# EAGLE design StatusBot-1 (EAGLE 7.2.0)
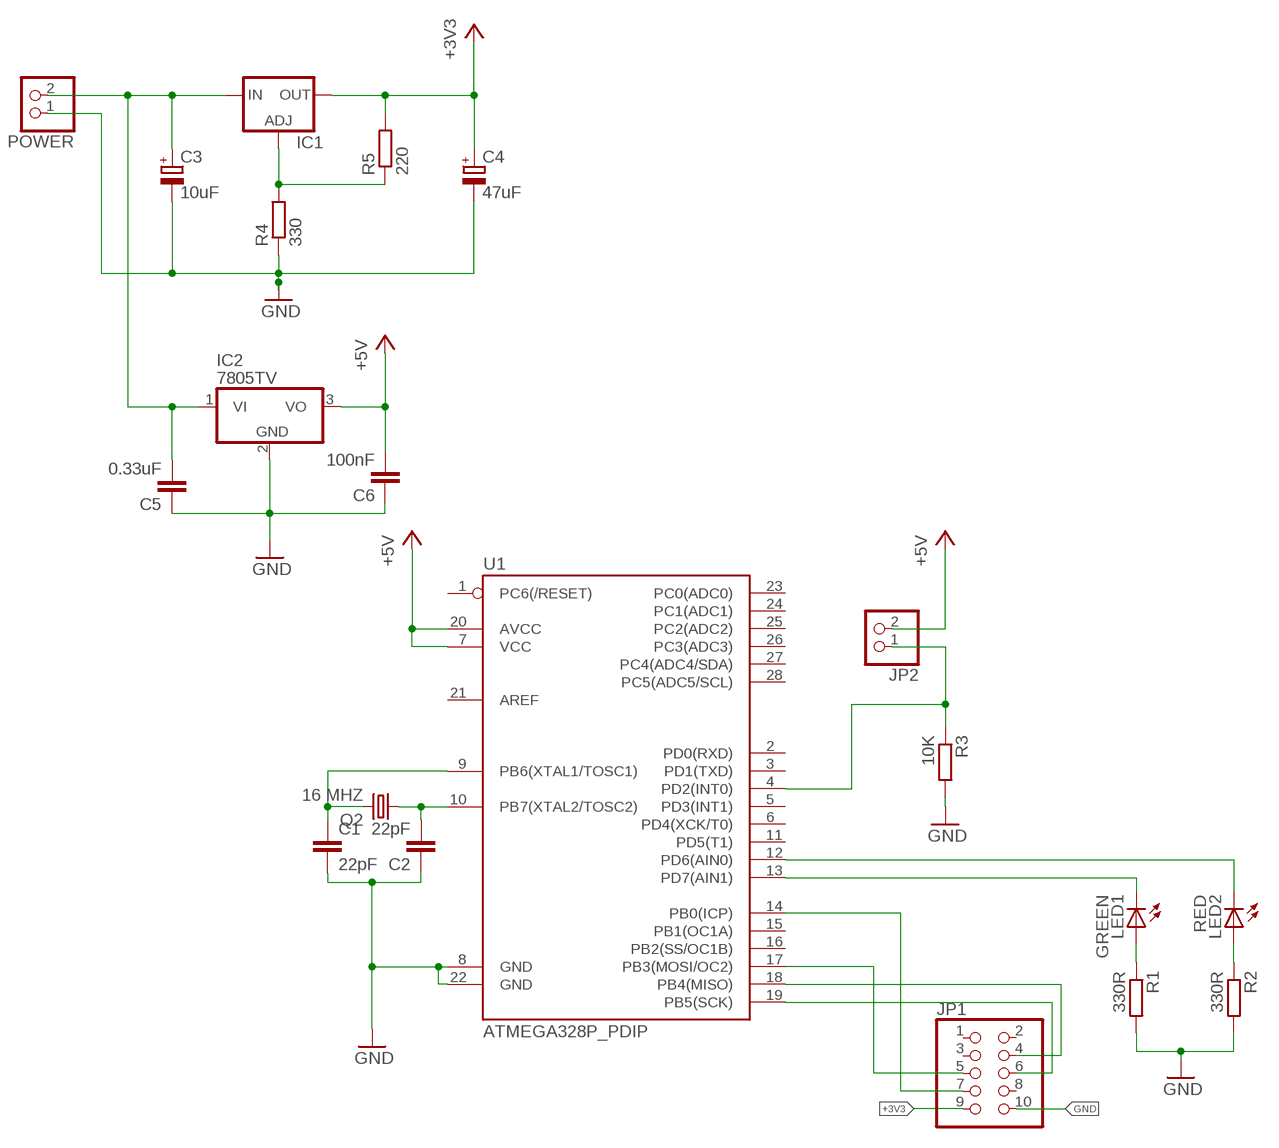
[diagram p0: schematic, sheet 1]

## Parts
C1  22pF  C-EU025-024X044  [C025-024X044]
C2  22pF  C-EU025-024X044  [C025-024X044]
C3  10uF  CPOL-EUE3.5-8  [E3,5-8]
C4  47uF  CPOL-EUE3.5-8  [E3,5-8]
C5  0.33uF  C-EU025-024X044  [C025-024X044]
C6  100nF  C-EU025-024X044  [C025-024X044]
IC1  LM317TS  [317TS]
IC2  7805TV  [TO220V]
JP1  PINHD-2X5  [2X05]
JP2  PINHD-1X2  [1X02]
LED1  GREEN  LED5MM  [LED5MM]
LED2  RED  LED5MM  [LED5MM]
POWER  PINHD-1X2  [1X02]
Q2  16 MHZ  CRYSTALHC49S  [HC49/S]
R1  330R  R-EU_0204/5  [0204/5]
R2  330R  R-EU_0204/5  [0204/5]
R3  10K  R-EU_0204/5  [0204/5]
R4  330  R-EU_0207/10  [0207/10]
R5  220  R-EU_0207/10  [0207/10]
U1  ATMEGA328P_PDIP  [DIL28-3]

## Nets
+3V3: C4.+ IC1.2(OUT) JP1.9 R5.2
+5V: C6.2 IC2.3(VO) JP2.2 U1.7(VCC) U1.20(AVCC)
GND: C1.2 C2.1 C3.- C4.- C5.1 C6.1 IC2.2(GND) JP1.10 POWER.1 R1.2 R2.2 R3.2 R4.1 U1.8(GND) U1.22(GND)
N$1: C2.2 Q2.1 U1.10(PB7(XTAL2/TOSC2))
N$2: JP1.7 U1.14(PB0(ICP))
N$3: JP2.1 R3.1 U1.4(PD2(INT0))
N$4: C1.1 Q2.2 U1.9(PB6(XTAL1/TOSC1))
N$5: C3.+ C5.2 IC1.3(IN) IC2.1(VI) POWER.2
N$6: LED1.A R1.1
N$7: LED2.A R2.1
N$8: JP1.5 U1.17(PB3(MOSI/OC2))
N$9: LED2.K(C) U1.12(PD6(AIN0))
N$10: LED1.K(C) U1.13(PD7(AIN1))
N$11: JP1.4 U1.18(PB4(MISO))
N$12: JP1.6 U1.19(PB5(SCK))
N$14: IC1.1(ADJ) R4.2 R5.1
Unconnected: JP1.1 JP1.2 JP1.3 JP1.8 U1.1(PC6(/RESET)) U1.2(PD0(RXD)) U1.3(PD1(TXD)) U1.5(PD3(INT1)) U1.6(PD4(XCK/T0)) U1.11(PD5(T1)) U1.15(PB1(OC1A)) U1.16(PB2(SS/OC1B)) U1.21(AREF) U1.23(PC0(ADC0)) U1.24(PC1(ADC1)) U1.25(PC2(ADC2)) U1.26(PC3(ADC3)) U1.27(PC4(ADC4/SDA)) U1.28(PC5(ADC5/SCL))

## Library data of the parts
C1 C2 C5 C6 = rcl:C-EU: CAPACITOR, European symbol
C3 C4 = resistor:CPOL-EU: POLARIZED CAPACITOR, European symbol
IC1 = v-reg:LM317TS: VOLTAGE REGULATOR
IC2 = linear:78*: Positive VOLTAGE REGULATOR Source: http://cache.national.com/ds/LM/LM78L05.pdf http://www.fairchildsemi.com/ds/LM/LM7805.pdf
JP1 = pinhead:PINHD-2X5: PIN HEADER
JP2 POWER = pinhead:PINHD-1X2: PIN HEADER
LED1 LED2 = led:LED: LED OSRAM: - CHIPLED LG R971, LG N971, LY N971, LG Q971, LY Q971, LO R971, LY R971 LH N974, LH R974 LS Q976, LO Q976, LY Q976 LO Q996 - Hyper CHIPLED LW Q18S LB Q993, LB Q99A, LB R99A - SideLED LS A670, LO A670, LY A670, LG A670, LP A670 LB A673, LV A673, LT A673, LW A673 LH A674 LY A675 LS A676, LA A676, LO A676, LY A676, LW A676 LS A679, LY A679, LG A679 - Hyper Micro SIDELED® LS Y876, LA Y876, LO Y876, LY Y876 LT Y87S - SmartLED LW L88C, LW L88S LB L89C, LB L89S, LG L890 LS L89K, LO L89K, LY L89K LS L896, LA L896, LO L896, LY L896 - TOPLED LS T670, LO T670, LY T670, LG T670, LP T670 LSG T670, LSP T670, LSY T670, LOP T670, LYG T670 LG T671, LOG T671, LSG T671 LB T673, LV T673, LT T673, LW T673 LH T674 LS T676, LA T676, LO T676, LY T676, LB T676, LH T676, LSB T676, LW T676 LB T67C, LV T67C, LT T67C, LS T67K, LO T67K, LY T67K, LW E67C LS E67B, LA E67B, LO E67B, LY E67B, LB E67C, LV E67C, LT E67C LW T67C LS T679, LY T679, LG T679 LS T770, LO T770, LY T770, LG T770, LP T770 LB T773, LV T773, LT T773, LW T773 LH T774 LS E675, LA E675, LY E675, LS T675 LS T776, LA T776, LO T776, LY T776, LB T776 LHGB T686 LT T68C, LB T68C - Hyper Mini TOPLED® LB M676 - Mini TOPLED Santana® LG M470 LS M47K, LO M47K, LY M47K Source: http://www.osram.convergy.de LUXEON: - LUMILED® LXK2-PW12-R00, LXK2-PW12-S00, LXK2-PW14-U00, LXK2-PW14-V00 LXK2-PM12-R00, LXK2-PM12-S00, LXK2-PM14-U00 LXK2-PE12-Q00, LXK2-PE12-R00, LXK2-PE12-S00, LXK2-PE14-T00, LXK2-PE14-U00 LXK2-PB12-K00, LXK2-PB12-L00, LXK2-PB12-M00, LXK2-PB14-N00, LXK2-PB14-P00, LXK2-PB14-Q00 LXK2-PR12-L00, LXK2-PR12-M00, LXK2-PR14-Q00, LXK2-PR14-R00 LXK2-PD12-Q00, LXK2-PD12-R00, LXK2-PD12-S00 LXK2-PH12-R00, LXK2-PH12-S00 LXK2-PL12-P00, LXK2-PL12-Q00, LXK2-PL12-R00 Source: www.luxeon.com KINGBRIGHT: KA-3528ASYC Source: www.kingbright.com
Q2 = crystal:CRYSTAL: CRYSTAL; OC_FARNELL: 1667008; OC_NEWARK: unknown
R1-R3 = rcl:R-EU_: RESISTOR, European symbol
R4 R5 = resistor:R-EU_: RESISTOR, European symbol
U1 = SparkFun-DigitalIC:ATMEGA328P_PDIP: uC used in the Arduino 32kb flash, 1k EEPROM, 2k SRAM This is the through-hole version of this chip.

## Board
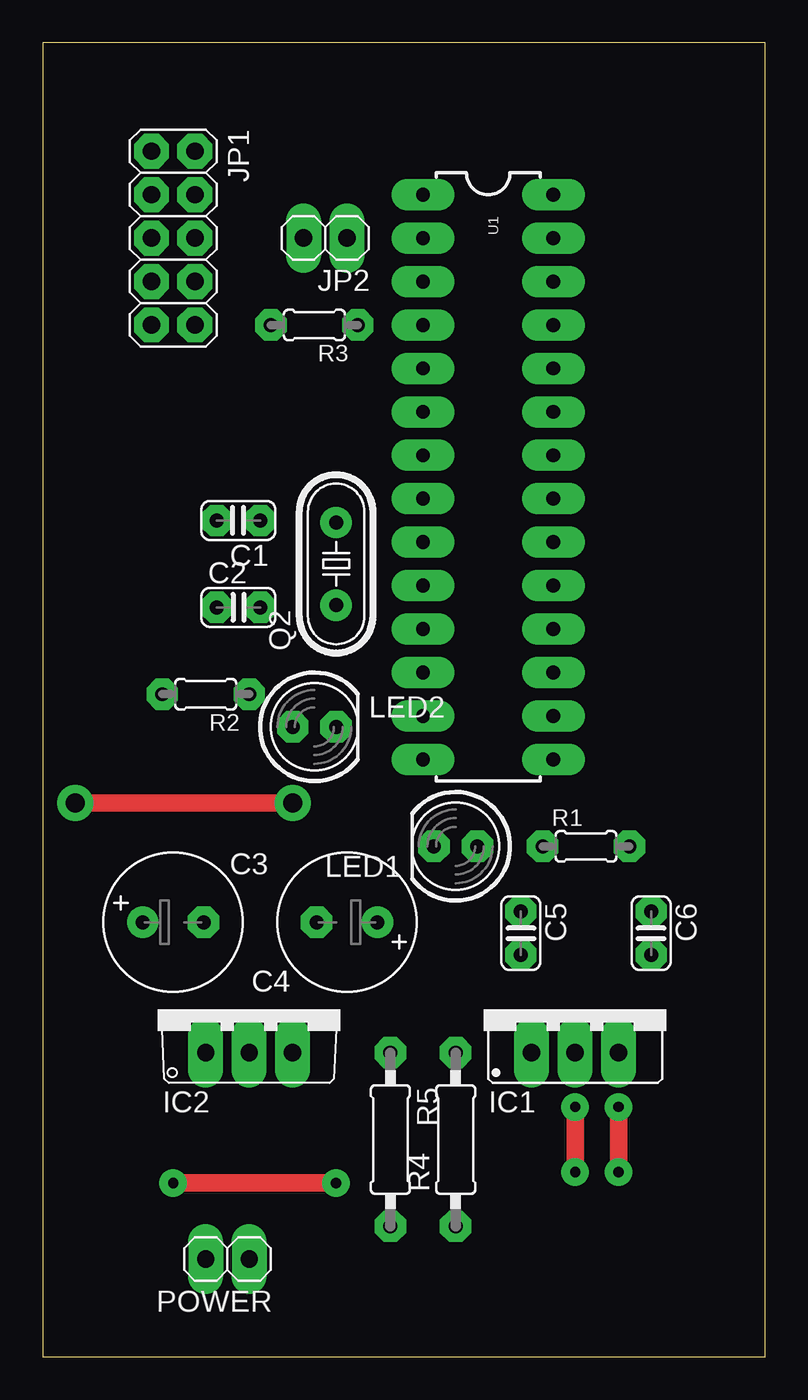
[diagram p1: board, top side]
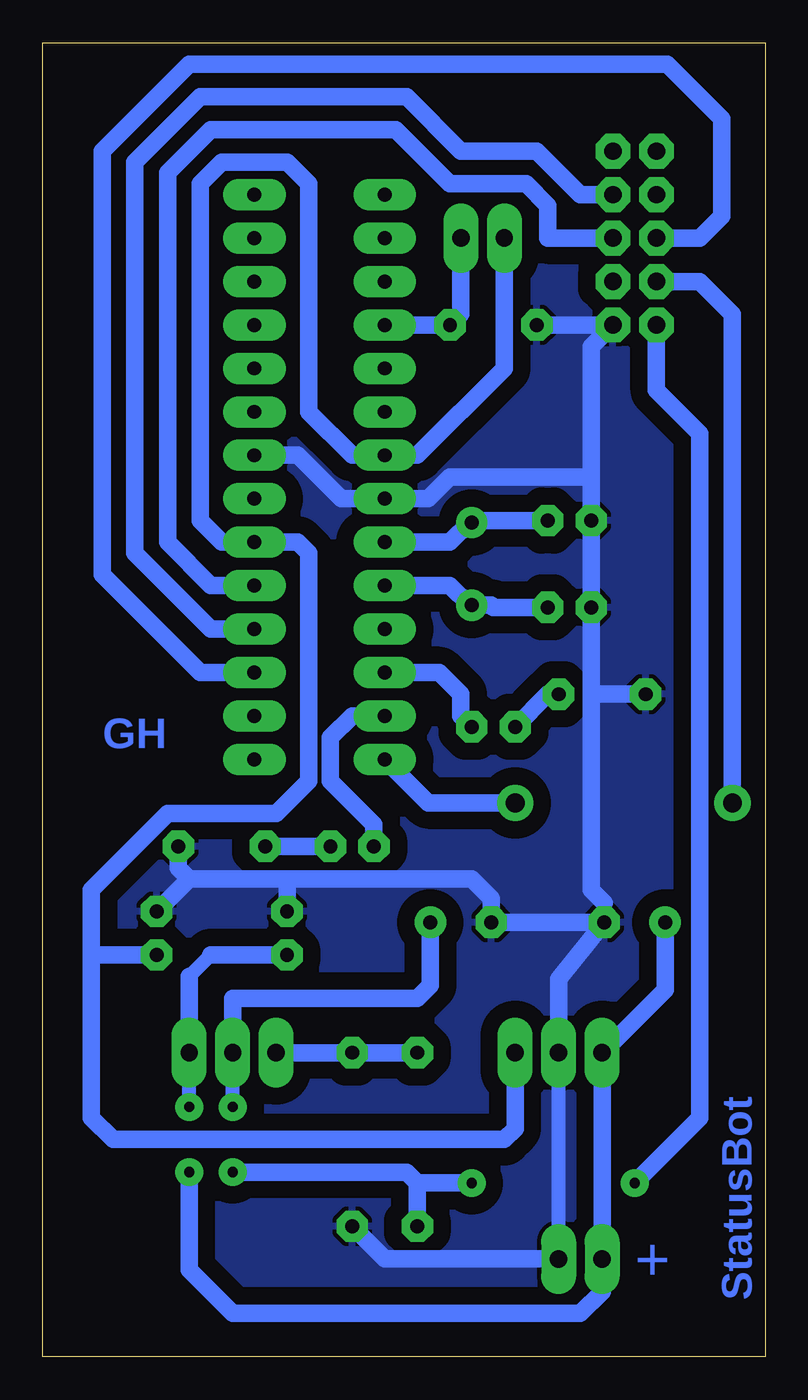
[diagram p2: board, bottom side, seen from below]

Size 42.22 x 76.83 mm. Coordinates in mm from the lower left corner, seen from the top.
Outline: 0,0 42.22,0 42.22,76.83 0,76.83 0,0
Copper layers (1*16): Top 0.035mm / dielectric 1.5mm / Bottom 0.035mm
Design rules "default *": minimum track width 40mil, minimum drill 24mil, track to track 32mil, track to pad 8mil, pad to pad 8mil, via to via 8mil, smd to smd 8mil, copper to edge 40mil, drill to drill 8mil, minimum pad ring 20mil, minimum via ring 20mil, stop-mask expansion 4mil, vias tented up to drill 0mil, thermal gap 10mil

### Footprints (pad centres in the part's own frame; a part is rotated, then mirrored left to right if it is on the bottom)
C025-024X044 = drill 0.813 octagon: 1 -1.27,0; 2 1.27,0
E3,5-8 = drill 0.813 pad 1.6: + -1.778,0 | drill 0.813 pad 1.6 octagon: - 1.778,0
317TS = drill 1.016 long: 1 -2.54,-2.54; 2 0,-2.54; 3 2.54,-2.54
TO220V = drill 1.016 long: 1 -2.54,-2.54; 2 0,-2.54; 3 2.54,-2.54
2X05 = drill 1.016 octagon: 1 -5.08,-1.27; 2 -5.08,1.27; 3 -2.54,-1.27; 4 -2.54,1.27; 5 0,-1.27; 6 0,1.27; 7 2.54,-1.27; 8 2.54,1.27; 9 5.08,-1.27; 10 5.08,1.27
1X02 = drill 1.016 long: 1 -1.27,0; 2 1.27,0
LED5MM = drill 0.813 octagon: A -1.27,0; K 1.27,0
HC49/S = drill 0.813: 1 -2.413,0; 2 2.413,0
0204/5 = drill 0.813 octagon: 1 -2.54,0; 2 2.54,0
0207/10 = drill 0.813 octagon: 1 -5.08,0; 2 5.08,0
DIL28-3 = drill 0.813 long: 1 -16.51,-3.81; 2 -13.97,-3.81; 3 -11.43,-3.81; 4 -8.89,-3.81; 5 -6.35,-3.81; 6 -3.81,-3.81; 7 -1.27,-3.81; 8 1.27,-3.81; 9 3.81,-3.81; 10 6.35,-3.81; 11 8.89,-3.81; 12 11.43,-3.81; 13 13.97,-3.81; 14 16.51,-3.81; 15 16.51,3.81; 16 13.97,3.81; 17 11.43,3.81; 18 8.89,3.81; 19 6.35,3.81; 20 3.81,3.81; 21 1.27,3.81; 22 -1.27,3.81; 23 -3.81,3.81; 24 -6.35,3.81; 25 -8.89,3.81; 26 -11.43,3.81; 27 -13.97,3.81; 28 -16.51,3.81

### Placement (x,y rotation side)
C1  11.43,48.9 180 top
C2  11.43,43.81 0 top
C3  7.62,25.4 0 top
C4  17.78,25.4 180 top
C5  27.94,24.77 270 top
C6  35.56,24.77 270 top
IC1  31.11,20.32 0 top
IC2  12.06,20.32 0 top
JP1  7.62,65.41 270 top
JP2  16.51,65.41 180 top
LED1  24.13,29.84 180 top
LED2  15.88,36.83 0 top
POWER  10.79,5.71 180 top
Q2  17.14,46.35 90 top
R1  31.75,29.84 0 top
R2  9.53,38.73 180 top
R3  15.88,60.33 180 top
R4  24.13,12.7 90 top
R5  20.32,12.7 270 top
U1  26.04,51.44 270 top

### Tracks (layer width: path | path; a pad name or v marks a point on that pad's centre or on a via)
+3V3  (via drill 0.6)
  Top 1.016: v31.11,10.79 v31.11,14.61 | v7.62,10.16 v17.14,10.16
  Bottom 0.813: v31.11,14.61 IC1.2
  Bottom 1.016: R5.2 20.32,10.16 | 20.32,10.16 20.95,10.79 v31.11,10.79 | C4.+ 19.56,21.72 20.32,20.95 31.11,20.95 IC1.2 | v17.14,10.16 20.32,10.16 | v7.62,10.16 3.81,13.97 3.81,53.98 6.35,56.52 JP1.9
+5V
  Bottom 1.016: 39.37,23.5 39.37,13.97 38.1,12.7 15.24,12.7 14.61,13.34 IC2.3 | C6.2 39.37,23.5 | JP2.2 15.24,57.78 20.32,52.7 U1.7 24.13,52.7 26.67,55.24 26.67,68.58 27.94,69.85 31.75,69.85 33.02,68.58 33.02,48.9 31.75,47.62 U1.20 27.3,47.62 26.67,46.99 26.67,33.66 28.57,31.75 34.92,31.75 39.37,27.3 39.37,23.5
GND
  Bottom 0.813: POWER.1 IC2.2 | 9.4,26.54 C3.-
  Bottom 1.016: IC2.2 12.06,22.1 C3.- C4.- 16,26.8 17.14,27.94 27.94,27.94 | POWER.1 22.23,5.71 R4.1 | 27.94,27.94 33.66,27.94 | 10.16,38.73 10.16,27.3 9.4,26.54 | R2.2 10.16,38.73 | 33.66,27.94 34.29,28.57 R1.2 | C5.1 27.94,27.94 | 33.66,27.94 C6.1 | R3.2 JP1.10 10.16,59.05 10.16,51.44 | 10.16,51.44 C1.2 C2.1 10.16,38.73 | U1.22 27.3,52.7 24.77,50.16 U1.8 19.68,50.16 18.41,51.44 10.16,51.44
  pour Bottom (isolate 1.016): 0,76.83 0,0 41.91,0 41.91,76.83
N$1
  Bottom 1.016: U1.10 18.41,45.09 17.27,43.94 Q2.1 16,43.94 15.88,43.81 C2.2
N$2  (via drill 1.1)
  Top 1.016: v14.61,32.38 v1.91,32.38
  Bottom 1.016: U1.14 19.68,32.38 v14.61,32.38 | v1.91,32.38 1.91,60.96 3.81,62.87 JP1.7
N$3
  Bottom 1.016: U1.4 R3.1 17.78,60.96 JP2.1
N$4
  Bottom 1.016: U1.9 18.41,47.62 17.27,48.77 Q2.2 17.02,48.9 C1.1
N$5  (via drill 0.6)
  Top 1.016: v33.66,10.79 v33.66,14.61
  Bottom 0.813: POWER.2 IC2.1 | v33.66,14.61 IC1.3 | 32.38,23.5 33.66,22.23
  Bottom 1.016: C3.+ 5.84,21.46 IC2.1 9.53,3.81 10.79,2.54 31.11,2.54 33.66,5.08 v33.66,10.79 | C5.2 32.38,23.5 | 33.66,22.23 IC1.3
N$6
  Bottom 1.016: LED1.A R1.1
N$7
  Bottom 1.016: R2.1 12.7,38.73 LED2.A
N$8
  Bottom 1.016: U1.17 33.02,40.01 38.73,45.72 38.73,70.48 33.66,75.56 5.71,75.56 2.54,72.39 2.54,66.67 3.81,65.41 JP1.5
N$9
  Bottom 1.016: LED2.K 17.78,37.47 17.78,38.73 19.05,40.01 U1.12
N$10
  Bottom 1.016: U1.13 24.13,37.47 25.4,36.2 25.4,33.66 22.86,31.11 LED1.K
N$11
  Bottom 1.016: U1.18 32.38,42.55 36.83,46.99 36.83,69.85 33.02,73.66 20.95,73.66 17.78,70.48 13.34,70.48 10.79,67.94 JP1.4
N$12
  Bottom 1.016: U1.19 32.38,45.09 34.92,47.62 34.92,69.22 32.38,71.75 21.59,71.75 18.41,68.58 13.97,68.58 12.7,67.31 12.7,65.41 JP1.6
N$14
  Bottom 1.016: R5.1 R4.2 IC1.1

### Text on the board
Bottom: GH | StatusBot | +